# EAGLE design breakouts (EAGLE 6.5.0)
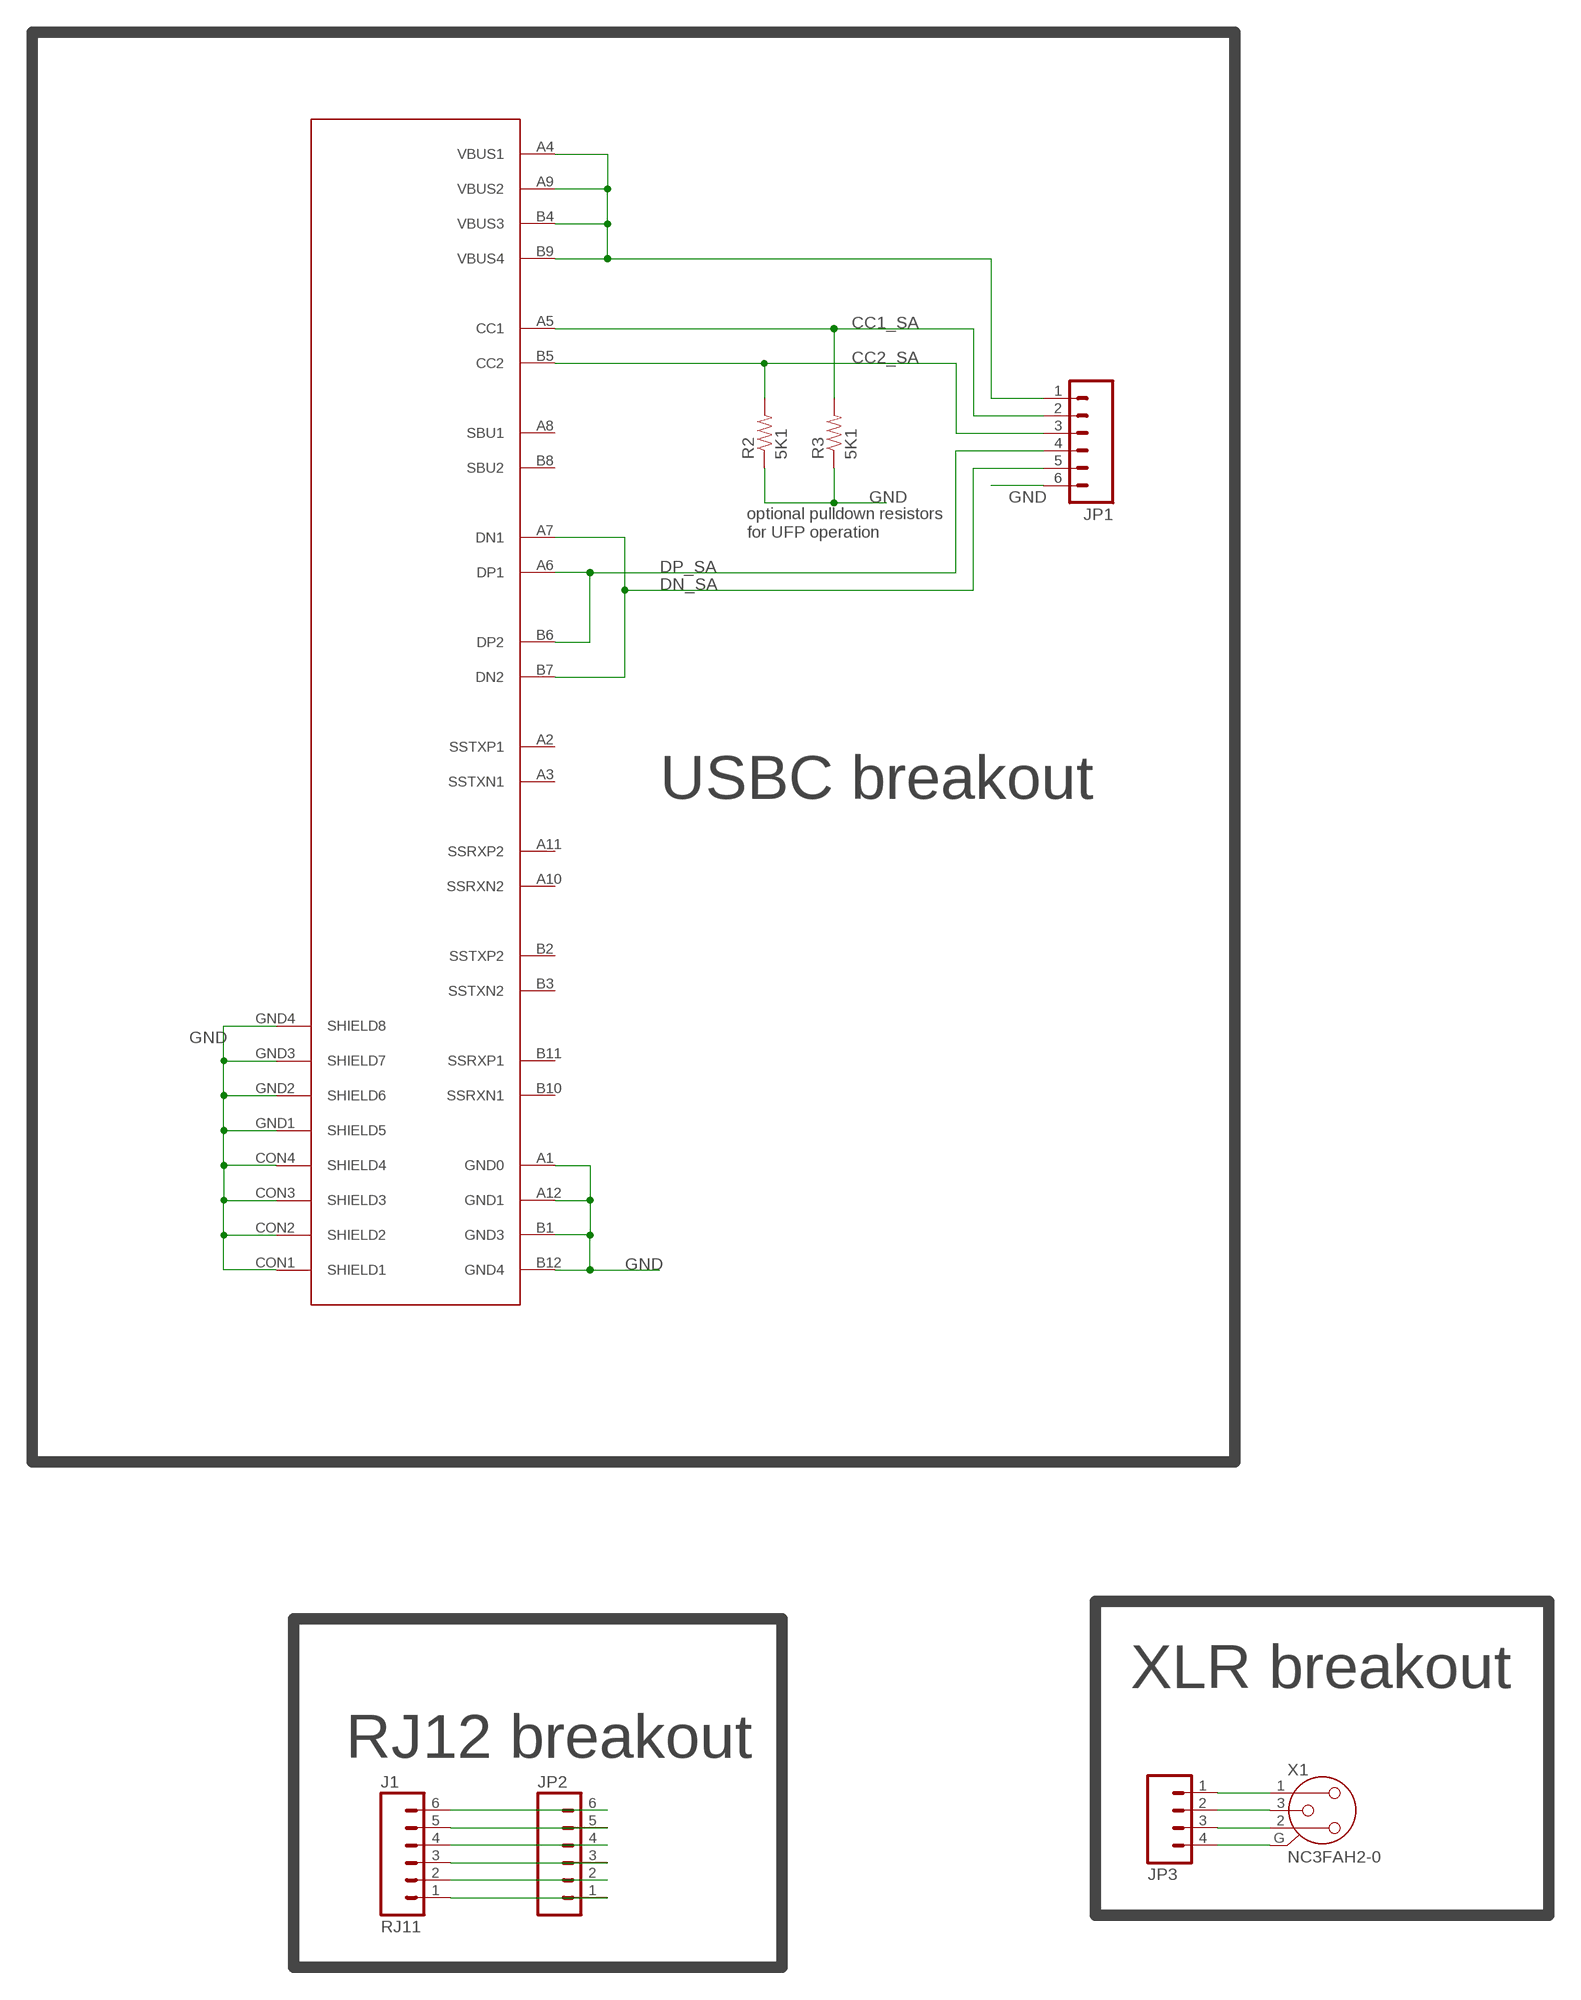
[diagram p0: schematic, sheet 1, part 1 of 2]
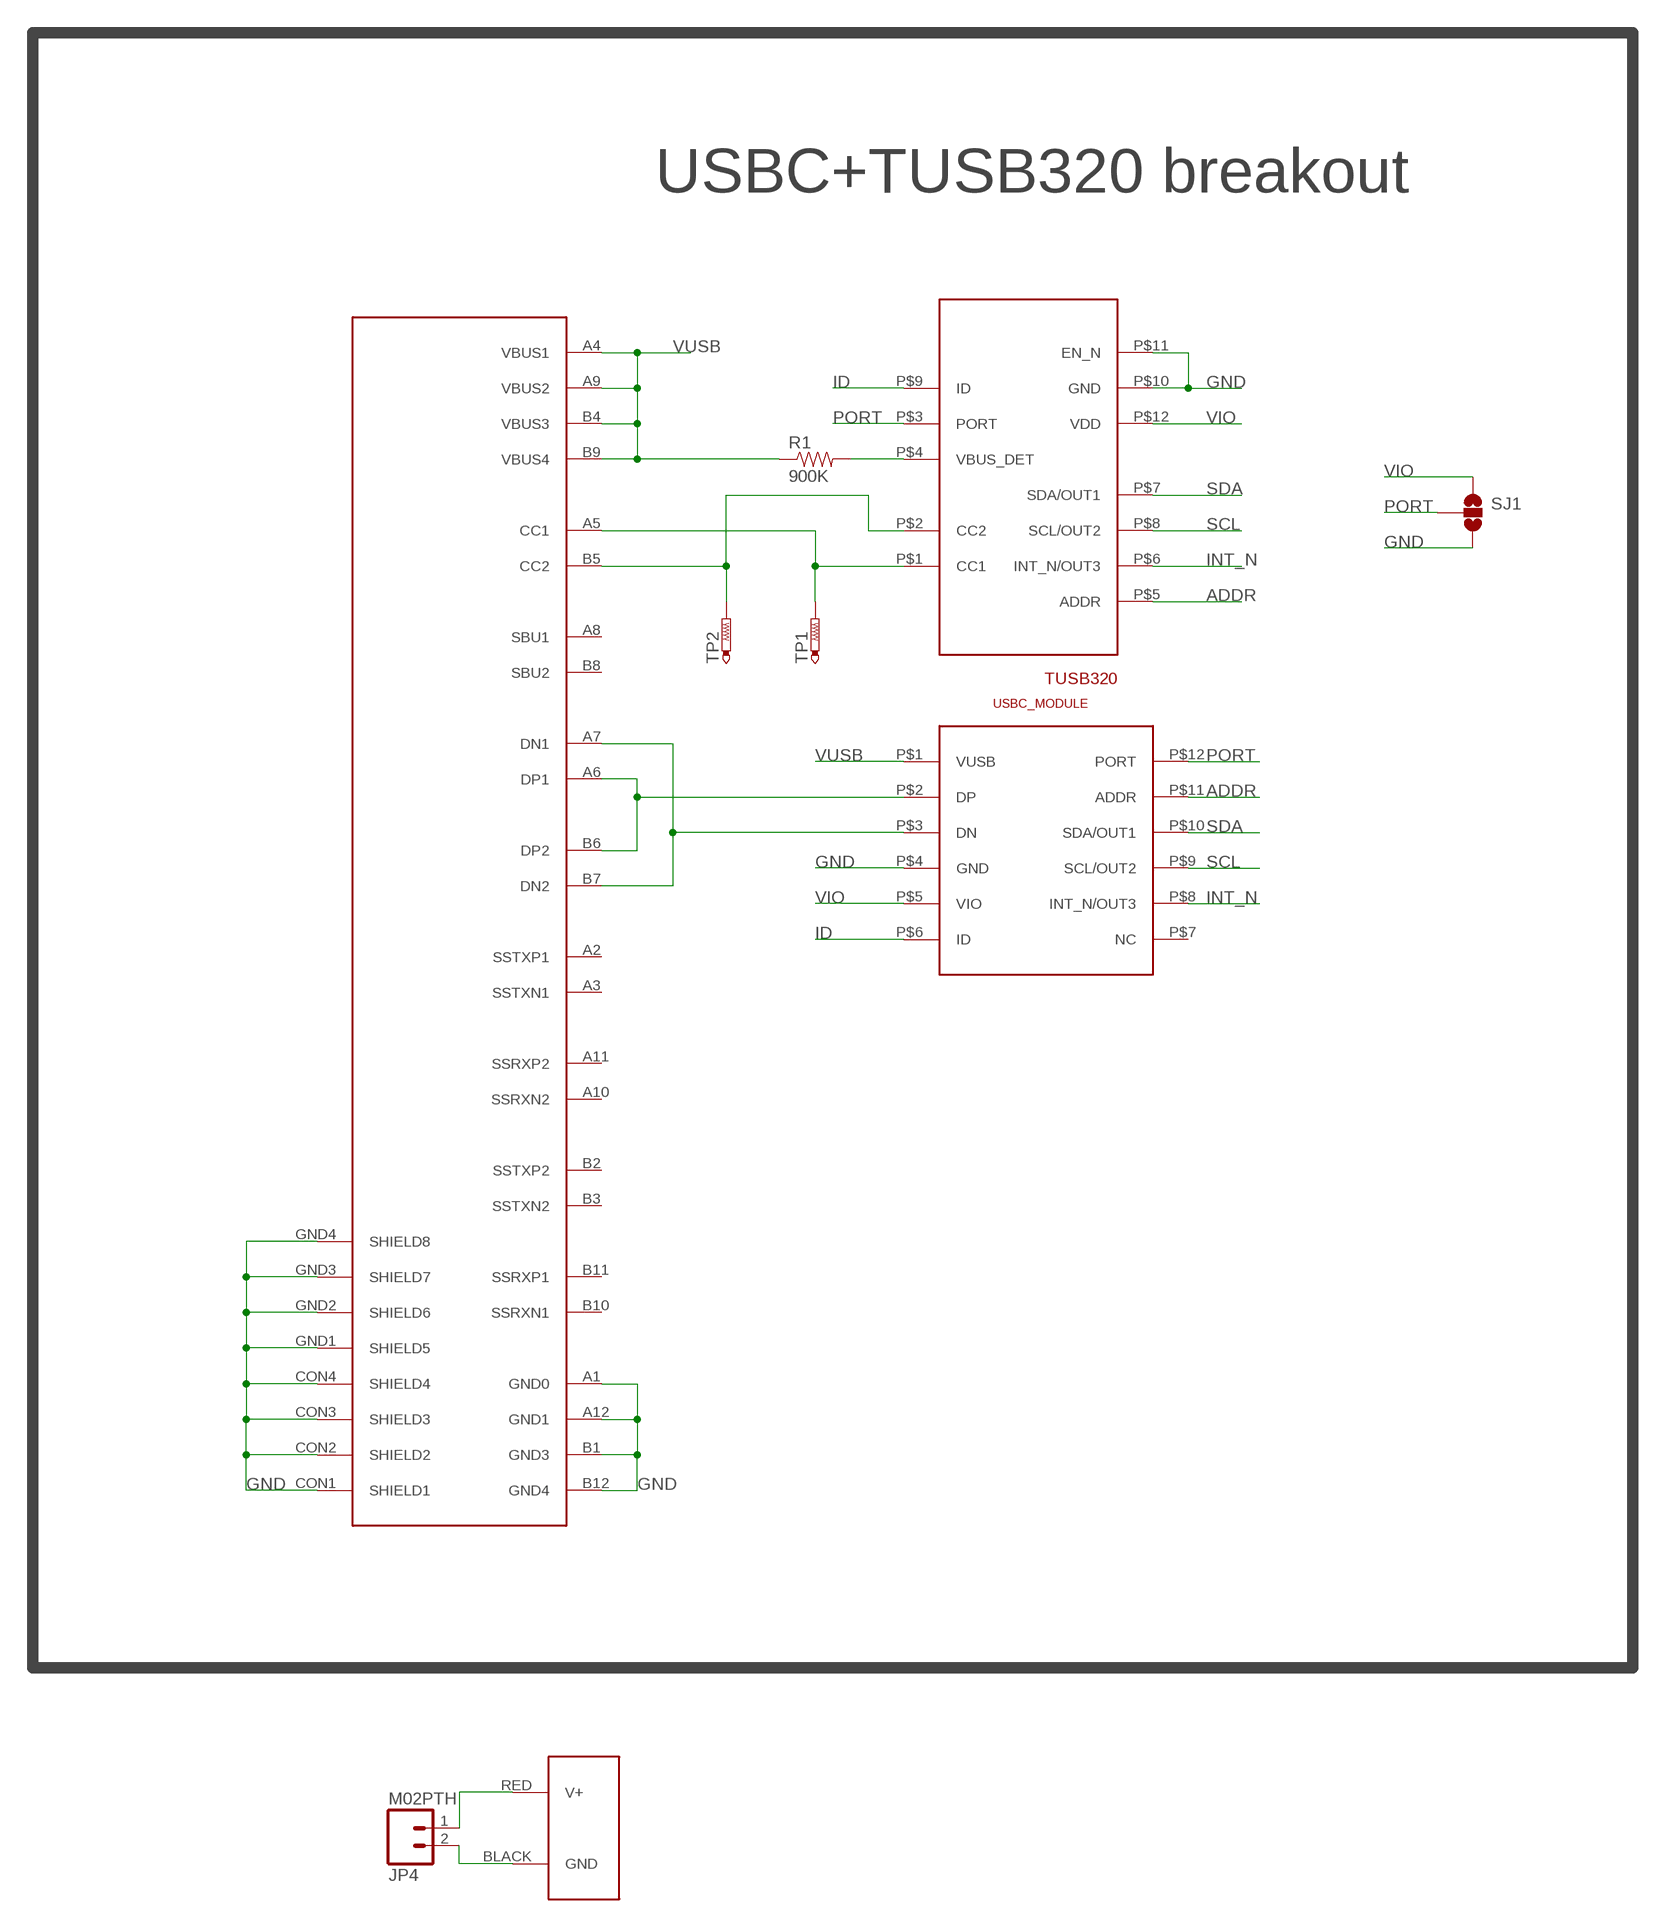
[diagram p1: schematic, sheet 1, part 2 of 2]

## Parts
CONN1  USB-C_WURTH_632723X00011USB-C  [USB-C_WURTH_632723X00011]
CONN2  USB-C_WURTH_632723X00011USB-C  [USB-C_WURTH_632723X00011]
J1  RJ11  RJ11-6PTH  [RJ11-6]
J2  POWERPOLE_POWER25A  [POWERPOLE_PAIR_25A]
JP1  M06SIP  [1X06]
JP2  M06SIP  [1X06]
JP3  M04PTH  [1X04]
JP4  M02PTH  [1X02]
R1  900K  RESISTOR0603-RES  [0603-RES]
R2  5K1  RESISTOR0603-RES  [0603-RES]
R3  5K1  RESISTOR0603-RES  [0603-RES]
SJ1  SOLDERJUMPER_2WAYS  [SJ_3]
TP1  PTR1TP10R  [TP10R]
TP2  PTR1TP10R  [TP10R]
U$1  TUSB320XQFN  [X2QFN]
U$2  USBC_BREAKOUTPDIP  [DIP12_6WIDE]
X1  NC3FAH2-0  [NC3FAH2-0]

## Nets
ADDR: U$1.P$5(ADDR) U$2.P$11(ADDR)
CC1: CONN1.A5(CC1) TP1.TP U$1.P$1(CC1)
CC1_SA: CONN2.A5(CC1) JP1.2 R3.2
CC2: CONN1.B5(CC2) TP2.TP U$1.P$2(CC2)
CC2_SA: CONN2.B5(CC2) JP1.3 R2.2
DN: CONN1.A7(DN1) CONN1.B7(DN2) U$2.P$3(DN)
DN_SA: CONN2.A7(DN1) CONN2.B7(DN2) JP1.5
DP: CONN1.A6(DP1) CONN1.B6(DP2) U$2.P$2(DP)
DP_SA: CONN2.A6(DP1) CONN2.B6(DP2) JP1.4
GND: CONN1.A1(GND0) CONN1.A12(GND1) CONN1.B1(GND3) CONN1.B12(GND4) CONN1.CON1(SHIELD1) CONN1.CON2(SHIELD2) CONN1.CON3(SHIELD3) CONN1.CON4(SHIELD4) CONN1.GND1(SHIELD5) CONN1.GND2(SHIELD6) CONN1.GND3(SHIELD7) CONN1.GND4(SHIELD8) CONN2.A1(GND0) CONN2.A12(GND1) CONN2.B1(GND3) CONN2.B12(GND4) CONN2.CON1(SHIELD1) CONN2.CON2(SHIELD2) CONN2.CON3(SHIELD3) CONN2.CON4(SHIELD4) CONN2.GND1(SHIELD5) CONN2.GND2(SHIELD6) CONN2.GND3(SHIELD7) CONN2.GND4(SHIELD8) JP1.6 R2.1 R3.1 SJ1.3 U$1.P$10(GND) U$1.P$11(EN_N) U$2.P$4(GND)
ID: U$1.P$9(ID) U$2.P$6(ID)
INT_N: U$1.P$6(INT_N/OUT3) U$2.P$8(INT_N/OUT3)
N$1: J1.1 JP2.1
N$2: J1.2 JP2.2
N$3: J1.3 JP2.3
N$4: J1.4 JP2.4
N$5: J1.5 JP2.5
N$6: J1.6 JP2.6
N$7: JP3.1 X1.1
N$8: JP3.2 X1.3
N$9: R1.2 U$1.P$4(VBUS_DET)
N$10: JP3.3 X1.2
N$11: JP3.4 X1.G
N$12: J2.RED(V+) JP4.1
N$13: J2.BLACK(GND) JP4.2
PORT: SJ1.2 U$1.P$3(PORT) U$2.P$12(PORT)
SCL: U$1.P$8(SCL/OUT2) U$2.P$9(SCL/OUT2)
SDA: U$1.P$7(SDA/OUT1) U$2.P$10(SDA/OUT1)
VBUS_SA: CONN2.A4(VBUS1) CONN2.A9(VBUS2) CONN2.B4(VBUS3) CONN2.B9(VBUS4) JP1.1
VIO: SJ1.1 U$1.P$12(VDD) U$2.P$5(VIO)
VUSB: CONN1.A4(VBUS1) CONN1.A9(VBUS2) CONN1.B4(VBUS3) CONN1.B9(VBUS4) R1.1 U$2.P$1(VUSB)
Unconnected: CONN1.A2(SSTXP1) CONN1.A3(SSTXN1) CONN1.A8(SBU1) CONN1.A10(SSRXN2) CONN1.A11(SSRXP2) CONN1.B2(SSTXP2) CONN1.B3(SSTXN2) CONN1.B8(SBU2) CONN1.B10(SSRXN1) CONN1.B11(SSRXP1) CONN2.A2(SSTXP1) CONN2.A3(SSTXN1) CONN2.A8(SBU1) CONN2.A10(SSRXN2) CONN2.A11(SSRXP2) CONN2.B2(SSTXP2) CONN2.B3(SSTXN2) CONN2.B8(SBU2) CONN2.B10(SSRXN1) CONN2.B11(SSRXP1) U$2.P$7(NC)

## Notes on the sheet
- USBC+TUSB320 breakout
- optional pulldown resistors
  for UFP operation
- USBC breakout
- XLR breakout
- RJ12 breakout

## Library data of the parts
CONN1 CONN2 = USB-C:USB-C_WURTH_632723X00011: Wurth USB C connector
J1 = SparkFun-Connectors:RJ11-6: RJ11 Jack Simple 6 pin RJ11 jack. Commonly found on CAT3 devices and Microchip programmers. SKU: PRT-00132; PROD_ID: CONN-08590
J2 = powerpoles:POWERPOLE_POWER: Anderson Powerpole Power Connector using ameteur radio standard layout
JP1 JP2 = SparkFun:M06: Header 6 Standard 6-pin 0.1" header. Use with straight break away headers (SKU : PRT-00116), right angle break away headers (PRT-00553), swiss pins (PRT-00743), machine pins (PRT-00117), and female headers (PRT-00115). Molex polarized connector foot print use with SKU : PRT-08094 with associated crimp pins and housings. NOTES ON THE VARIANTS LOCK and LOCK_LONGPADS... This footprint was designed to help hold the alignment of a through-hole component (i.e. 6-pin header) while soldering it into place. You may notice that each hole has been shifted either up or down by 0.005 of an inch from it's more standard position (which is a perfectly straight line). This slight alteration caused the pins (the squares in the middle) to touch the edges of the holes. Because they are alternating, it causes a "brace" to hold the component in place. 0.005 has proven to be the perfect amount of "off-center" position when using our standard breakaway headers. Although looks a little odd when you look at the bare footprint, once you have a header in there, the alteration is very hard to notice. Also, if you push a header all the way into place, it is covered up entirely on the bottom side. This idea of altering the position of holes to aid alignment will be further integrated into the Sparkfun Library for other footprints. It can help hold any component with 3 or more connection pins.
JP3 = SparkFun-Connectors:M04: Header 4 Standard 4-pin 0.1" header. Use with straight break away headers (SKU : PRT-00116), right angle break away headers (PRT-00553), swiss pins (PRT-00743), machine pins (PRT-00117), and female headers (PRT-00115). Molex polarized connector foot print use with SKU : PRT-08231 with associated crimp pins and housings. 1MM SMD Version SKU: PRT-10208
JP4 = SparkFun-Connectors:M02: Standard 2-pin 0.1" header. Use with - straight break away headers ( PRT-00116) - right angle break away headers (PRT-00553) - swiss pins (PRT-00743) - machine pins (PRT-00117) - female headers (PRT-00115) Molex polarized connector foot print use with: PRT-08233 with associated crimp pins and housings. 2.54_SCREWTERM for use with PRT-10571. 3.5mm Screw Terminal footprints for PRT-08084 5mm Screw Terminal footprints for use with PRT-08432
R1-R3 = SparkFun-Passives:RESISTOR: Resistor Basic schematic elements and footprints for 0603, 1206, and PTH resistors.
SJ1 = SparkFun:SOLDERJUMPER_2WAY: Solder Jumper 2 way solder jumper
TP1 TP2 = testpad:PTR1: TEST PIN
U$1 = USB-C:TUSB320: TUSB320 USB Type-C Configuration Channel Logic and Port Control
U$2 = USB-C:USBC_BREAKOUT: USB Type-C brekout module with TUSB320 Controler
X1 = con-neutrik_ag:NC3: Neutrik Audio Connector XLR SERIES Stereo 1/4" jack Source: www.neutrik.com/; MPN: NC3FAH-2-0; OC_FARNELL: unknown; OC_NEWARK: 11J5829

## Board
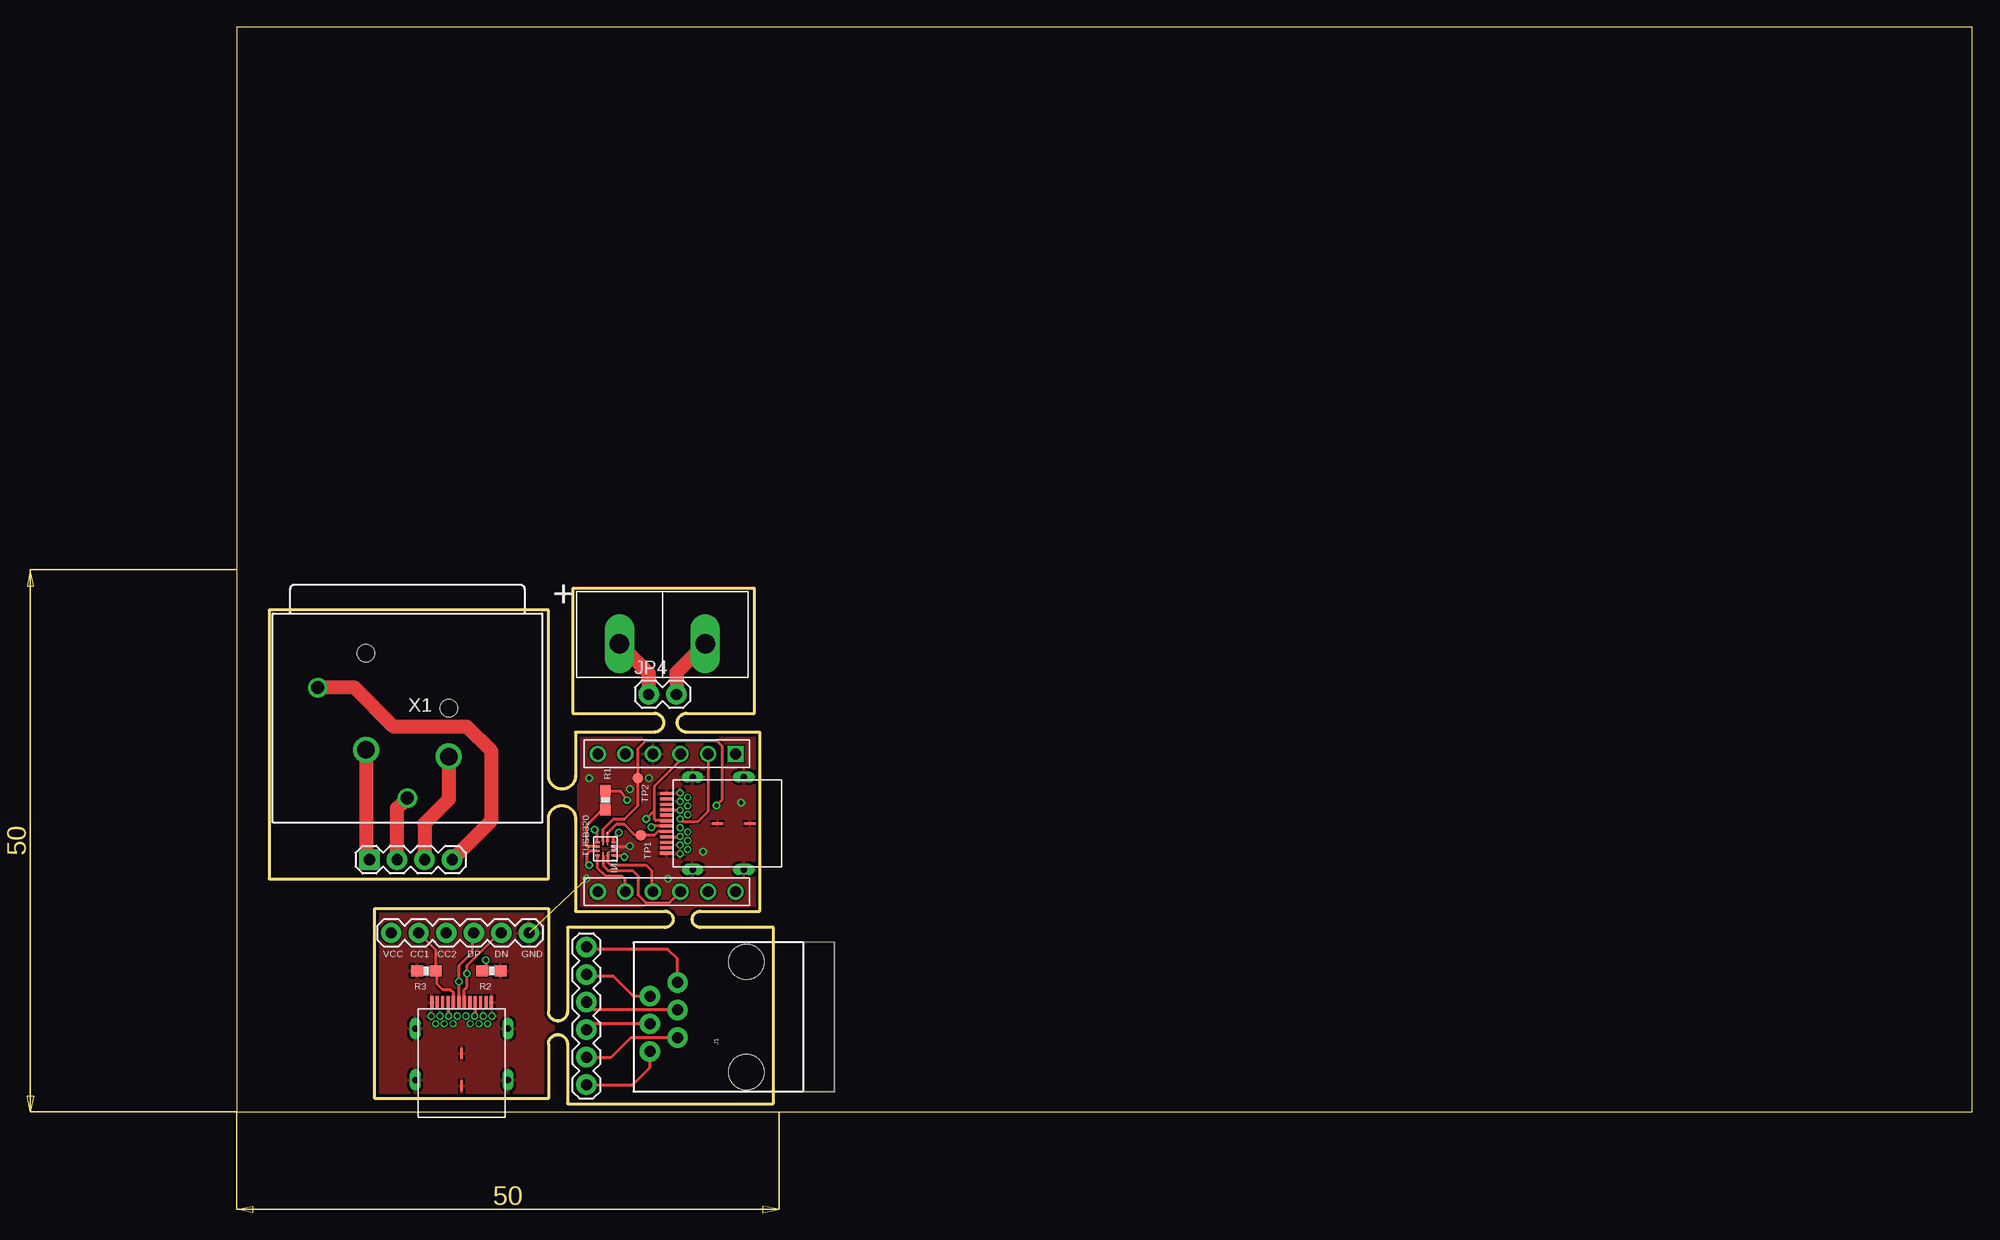
[diagram p2: board, top side]
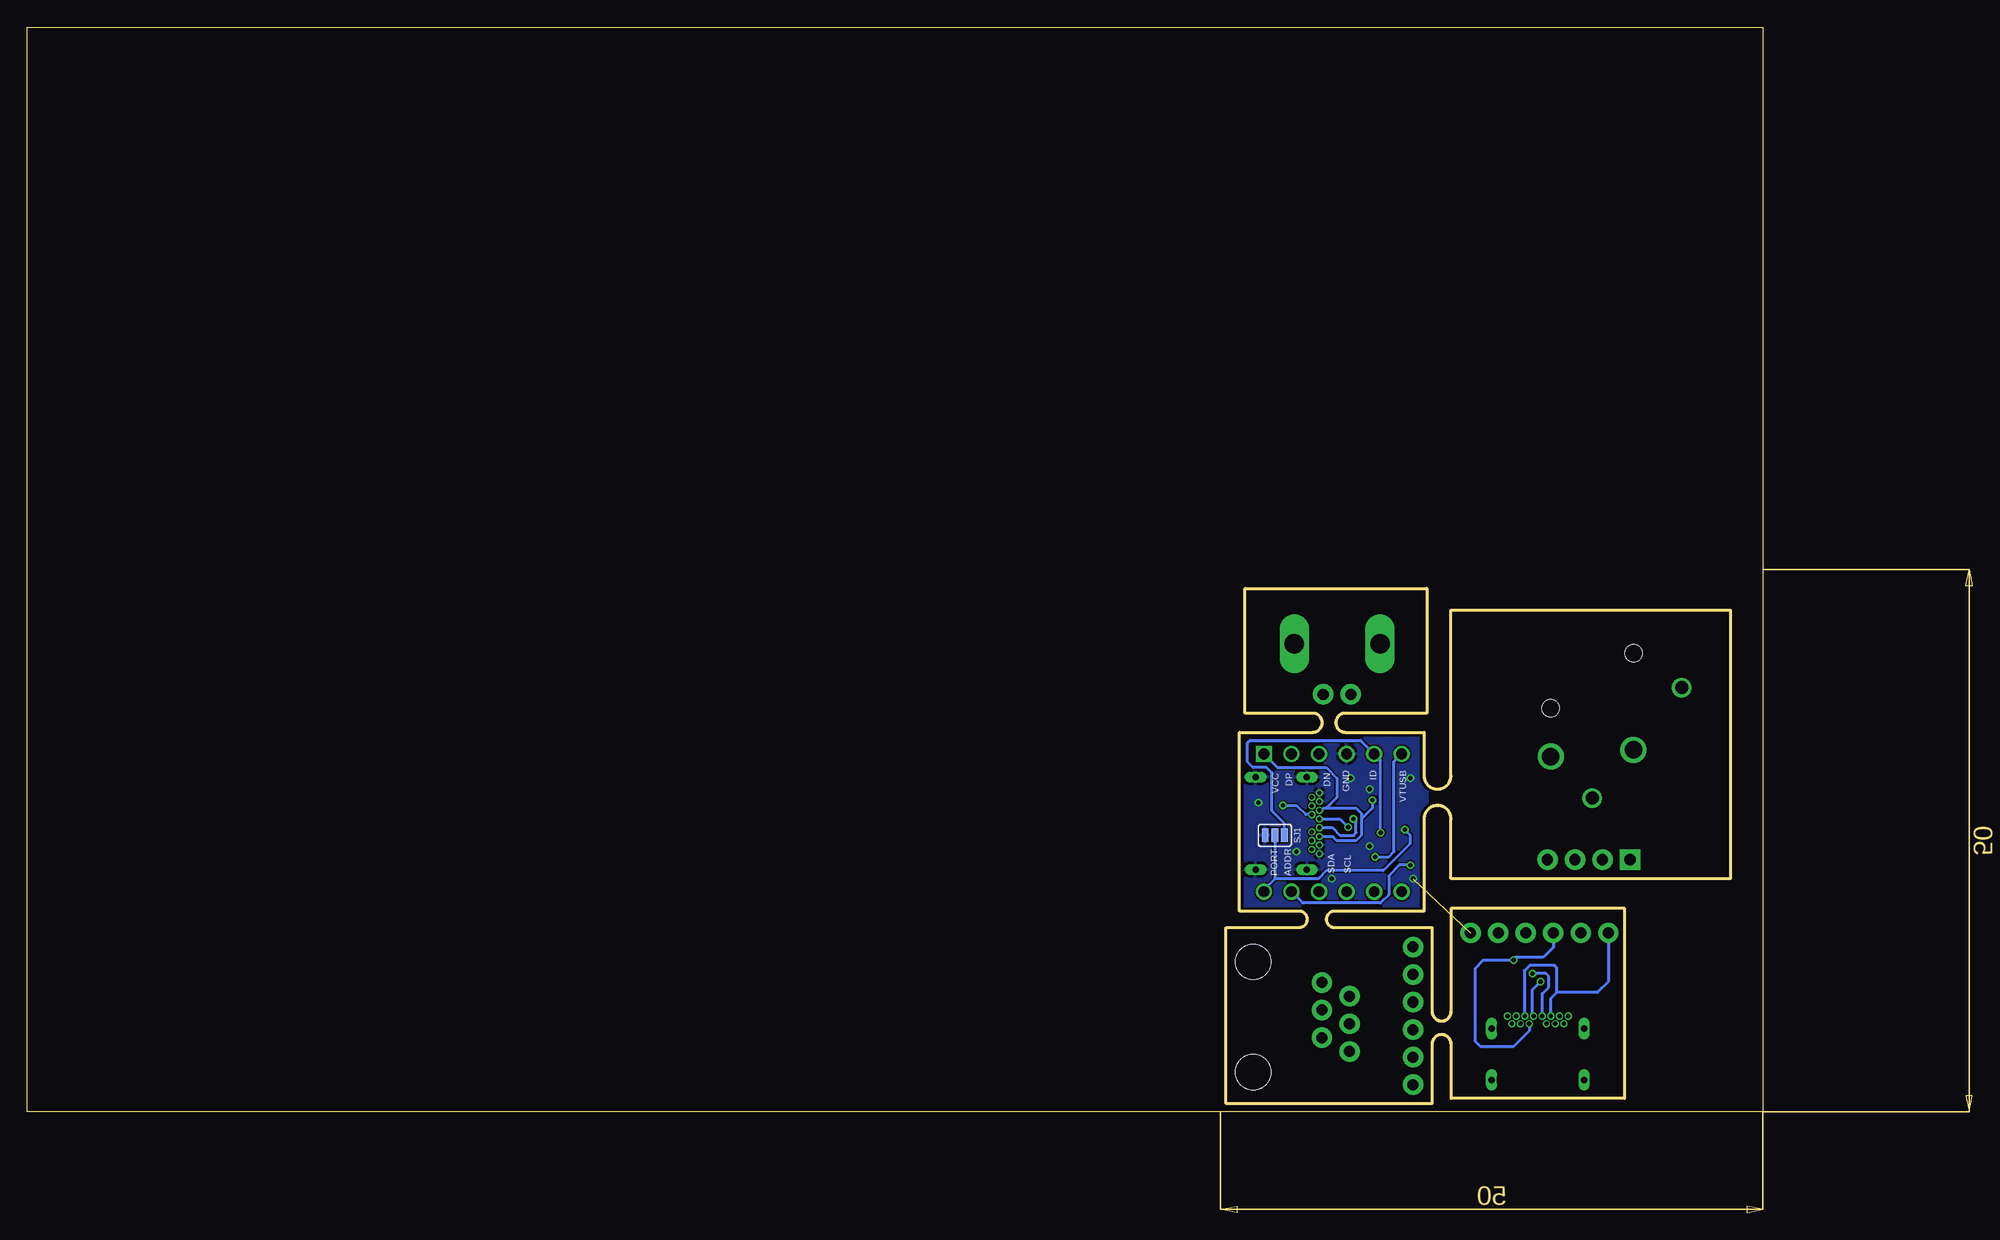
[diagram p3: board, bottom side, seen from below]

Size 160 x 100 mm. Coordinates in mm from the lower left corner, seen from the top.
Outline: 0,0 160,0 160,100 0,100 0,0
Outline: 12.75,1.25 28.75,1.25 28.75,6.25 arc-180 30.5,6.25 30.5,0.75 49.5,0.75 49.5,17 42.75,17 arc-180 42.75,18.5 48.25,18.5 48.25,35 41.5,35 arc-180 41.5,36.75 47.75,36.75 47.75,48.25 31,48.25 31,36.75 38.5,36.75 arc-180 38.5,35 31.25,35 31.25,31 arc-180 28.75,31 28.75,46.25 3,46.25 3,21.5 28.75,21.5 28.75,27 arc-180 31.25,27 31.25,18.5 39.5,18.5 arc-180 39.5,17 30.5,17 30.5,9.25 arc-180 28.75,9.25 28.75,18.75 12.75,18.75 12.75,1.25
Copper layers (1*16): Top 0.035mm / dielectric 1.5mm / Bottom 0.035mm
Design rules "dirt_cheap_dirty_boards.v1 *": minimum track width 5mil, minimum drill 12mil, track to track 5mil, track to pad 5mil, pad to pad 5mil, via to via 5mil, smd to smd 0mil, copper to edge 10mil, drill to drill 10mil, minimum pad ring 0.1mm, minimum via ring 6mil, stop-mask expansion 0mil, vias tented up to drill 25mil, thermal gap 10mil

### Footprints (pad centres in the part's own frame; a part is rotated, then mirrored left to right if it is on the bottom)
USB-C_WURTH_632723X00011 = smd 0.3 x 1.2: A1 -2.75,10.58; A2 -2.25,10.58; A3 -1.75,10.58; A4 -1.25,10.58; A5 -0.75,10.58; A6 -0.25,10.58; A7 0.25,10.58; A8 0.75,10.58; A9 1.25,10.58; A10 1.75,10.58; A11 2.25,10.58; A12 2.75,10.58 | drill 0.4 pad 0.65: B1 2.8,9.33; B2 2.4,8.63; B3 1.6,8.63; B4 1.2,9.33; B5 0.8,8.63; B6 0.4,9.33; B7 -0.4,9.33; B8 -0.8,8.63; B9 -1.2,9.33; B10 -1.6,8.63; B11 -2.4,8.63; B12 -2.8,9.33; GND1 2,9.33; GND2 -2,9.33 | drill 0.6 pad 1 long: CON1 4.27,8.18; CON2 4.27,3.45; CON3 -4.27,3.45; CON4 -4.27,8.18 | smd 0.2 x 1: GND3 0,2.9; GND4 0,5.9
RJ11-6 = drill 1.016 pad 1.88: 1 -3.175,8.89; 2 -1.905,6.35; 3 -0.635,8.89; 4 0.635,6.35; 5 1.905,8.89; 6 3.175,6.35 | hole 3.251: -5.08,0; 5.08,0
POWERPOLE_PAIR_25A = drill 1.8 long: BLACK 3.95,-0.85; RED -3.95,-0.85
1X06 = drill 1.016 pad 1.88: 1 0,0; 2 2.54,0; 3 5.08,0; 4 7.62,0; 5 10.16,0; 6 12.7,0
1X04 = drill 1.016 pad 1.88 square: 1 0,0 | drill 1.016 pad 1.88: 2 2.54,0; 3 5.08,0; 4 7.62,0
1X02 = drill 1.016 pad 1.88: 1 0,0; 2 2.54,0
0603-RES = smd 1.1 x 1: 1 -0.85,0; 2 0.85,0
SJ_3 = smd 0.635 x 1.27: 1 -0.889,0; 2 0,0; 3 0.889,0
TP10R = smd 1 x 1: TP 0,0
X2QFN = smd 0.7 x 0.2: P$1 -0.65,0.2; P$2 -0.65,-0.2; P$7 0.65,-0.2; P$8 0.65,0.2 | smd 0.2 x 0.5: P$3 -0.6,-0.75; P$4 -0.2,-0.75; P$5 0.2,-0.75; P$6 0.6,-0.75; P$9 0.6,0.75; P$10 0.2,0.75; P$11 -0.2,0.75; P$12 -0.6,0.75
DIP12_6WIDE = drill 1 square: P$1 0,0 | drill 1: P$2 0,-2.54; P$3 0,-5.08; P$4 0,-7.62; P$5 0,-10.16; P$6 0,-12.7; P$7 12.7,-12.7; P$8 12.7,-10.16; P$9 12.7,-7.62; P$10 12.7,-5.08; P$11 12.7,-2.54; P$12 12.7,0
NC3FAH2-0 = drill 1.6: 1 -3.81,0.635; 2 3.81,0 | drill 1.2: 3 0,-3.815; G -8.25,6.355 | hole 1.6: -3.81,9.525; 3.81,4.445

### Placement (x,y rotation side)
CONN1  50.22,26.6 90 top
CONN2  20.75,-0.5 0 top
J1  47,8.75 90 top
J2  39.25,44 0 top
JP1  14.25,16.5 0 top
JP2  32.25,2.5 90 top
JP3  12.25,23.25 0 top
JP4  38,38.5 0 top
R1  34,28.75 270 top
R2  23.5,13 180 top
R3  17.5,13 0 top
SJ1  45,25.5 180 bottom
TP1  37.25,25.5 90 top
TP2  37,30.75 90 top
U$1  34,24.25 270 top
U$2  46,33 270 top
X1  15.75,32.75 0 top

### Tracks (layer width: path | path; a pad name or v marks a point on that pad's centre or on a via)
ADDR  (via drill 0.4)
  Top 0.254: U$1.P$5 32.55,24.05 32.25,23.75 32.25,23 v32.5,22.75
  Bottom 0.254: v32.5,22.75 33.5,22.75 34.5,21.75 34.5,20 35.25,19.25 42.41,19.25 U$2.P$11
CC1
  Top 0.254: CONN1.A5 38.85,25.85 38.5,25.5 TP1.TP 36.75,25.5 35.75,26.5 35,26.5 34.2,25.7 U$1.P$1
CC1_SA
  Top 0.254: JP1.2 18.35,14.94 R3.2 18.5,12.85 18.5,11.75 19,11.25 19.75,11.25 20,11 CONN2.A5
CC2  (via drill 0.4)
  Top 0.254: U$1.P$2 33.8,26.05 34.75,27 35.75,27 37,28.25 TP2.TP 37,33.5 37.75,34.25 44.25,34.25 44.75,33.75 44.75,28.75 v44.25,28.25
  Bottom 0.254: v44.25,28.25 43,28.25 42.15,27.4 CONN1.B5
CC2_SA  (via drill 0.4)
  Top 0.254: v23,14 23,13.35 R2.2
  Bottom 0.254: JP1.3 19.33,15.17 20.25,14.25 22.75,14.25 v23,14 25.75,14 26.5,13.25 26.5,6.5 26,6 23,6 21.55,7.45 CONN2.B5
DN  (via drill 0.4)
  Top 0.254: U$2.P$3 40.92,32.42 38.5,30 38.5,27.75 | 38.5,27.75 38.5,27 38.65,26.85 CONN1.A7 | v37.75,27 38.5,27.75
  Bottom 0.254: CONN1.B7 39.7,26.2 39,25.5 37.75,25.5 37.5,25.75 37.5,26.75 v37.75,27
DN_SA  (via drill 0.4)
  Top 0.254: JP1.5 24.25,16.5 21.25,13.5 v21.25,12.75 21.25,11.5 21,11.25 CONN2.A7
  Bottom 0.254: CONN2.B7 20.35,10.9 19.75,11.5 19.75,12.5 20,12.75 v21.25,12.75
DP  (via drill 0.4)
  Top 0.254: U$2.P$2 43.46,27.71 42.5,26.75 41.14,26.75 CONN1.B6 | CONN1.A6 38.35,26.35 v38.25,26.25
  Bottom 0.254: CONN1.B6 39,27 v38.25,26.25
DP_SA  (via drill 0.4)
  Top 0.254: CONN2.A6 v20.5,12 20.5,13.5 21.75,14.75 21.75,16.38 JP1.4
  Bottom 0.254: CONN2.B6 21.25,8.93 21.25,11.25 v20.5,12
GND  (via drill 0.4)  (1 unrouted)
  Top 0.254: U$1.P$11 36.2,24.45 v36.25,24.5
  other vias: 36.25,29.75 32.5,30.75 38,30.75 43,24 46.5,28.5 39.75,21.5 32.25,21.5
  pour Top: 31.5,18.25 49,18.25 49,35.25 31.5,35.25
  pour Bottom: 31,18.25 48.75,18.25 48.75,35.25 31,35.25
  pour Top: 11.75,19.5 11.75,0.75 29.25,0.75 29.25,19.5
ID  (via drill 0.4)
  Top 0.254: U$1.P$9 35.6,23.65 v35.75,23.5
  Bottom 0.254: v35.75,23.5 34.5,23.5 34,24 34,32.3 U$2.P$6
INT_N
  Top 0.254: U$2.P$8 35.75,20.39 35.75,21.5 35.5,21.75 34,21.75 33.25,22.5 U$1.P$6
N$1
  Top 0.254: JP2.1 36.5,2.5 38.11,4.11 J1.1
N$2
  Top 0.254: J1.2 36.34,6.84 34.5,5 32.29,5 JP2.2
N$3
  Top 0.254: J1.3 32.78,8.12 JP2.3
N$4
  Top 0.254: J1.4 32.98,9.38 JP2.4
N$5
  Top 0.254: J1.5 36.59,10.65 34.75,12.5 32.41,12.5 JP2.5
N$6
  Top 0.254: J1.6 40.65,14.1 39.75,15 32.45,15 JP2.6
N$7
  Top 1.27: X1.1 11.94,23.56 JP3.1
N$8
  Top 1.27: JP3.2 14.79,27.98 X1.3
N$9
  Top 0.254: U$1.P$4 32.3,24.45 32.25,24.5 32.25,26.4 33.5,27.65 R1.2
N$10
  Top 1.27: X1.2 19.56,28.81 17.33,26.58 JP3.3
N$11
  Top 1.27: JP3.4 23.5,26.88 23.5,33.25 21.25,35.5 14.5,35.5 10.89,39.1 X1.G
N$12
  Top 1.27: J2.RED 38,40.45 JP4.1
N$13
  Top 1.27: J2.BLACK 40.54,40.49 JP4.2
PORT  (via drill 0.4)
  Top 0.254: U$1.P$3 33.25,25.75 v33,26
  Bottom 0.254: U$2.P$12 46,20.5 45,21.5 | SJ1.2 45,21.5 | v33,26 32.5,25.5 32.5,24.75 35,22.25 40.25,22.25 41,21.5 45,21.5
SCL
  Top 0.254: U$1.P$8 34.2,23.05 34.5,22.75 37.75,22.75 38.25,22.25 38.25,20.43 U$2.P$9
SDA
  Top 0.254: U$1.P$7 33.8,22.7 34.25,22.25 36.5,22.25 37,21.75 37,20 37.75,19.25 39.87,19.25 U$2.P$10
VBUS_SA
  Top 0.254: CONN2.A4 19.5,8.88 CONN2.B9 | CONN2.A9 22,8.88 CONN2.B4
  Bottom 0.254: CONN2.B9 19.55,10.45 19,11 | 19,11 19,13.25 19.25,13.5 21.5,13.5 22,13 22,8.88 CONN2.B4 | JP1.1 14.25,12 15.25,11 19,11
VIO  (via drill 0.4)
  Top 0.254: U$1.P$12 34.75,25.25 v35.25,25.75
  Bottom 0.254: v35.25,25.75 35.25,32.41 U$2.P$5 37.09,34.25 47.25,34.25 47.5,34 47.5,32.25 47,31.75 45.75,31.75 45.25,31.25 45.25,27.75 44.11,26.61 SJ1.1 44.11,25.36
VUSB  (via drill 0.4)
  Top 0.254: CONN1.A4 40.84,25.35 CONN1.B9 | CONN1.A9 40.84,27.85 CONN1.B4 | R1.1 35.4,29.6 v36,28.75
  Bottom 0.254: CONN1.B4 40.7,27.8 40.5,28 40.25,28 | 40.25,28 37.5,28 37,27.5 37,27 | 37,27 37,25.5 37.5,25 39.29,25 CONN1.A4 40.84,25.35 CONN1.B9 | U$2.P$1 44.75,31.75 40.25,31.75 39.25,30.75 39.25,29 40.25,28 | v36,28.75 36,28 37,27

### Text on the board
tNames: TUSB320 | INT_N | VCC | CC1 | CC2 | DP | DN | GND
bNames: VTUSB | ID | GND | DN | DP | VCC | SCL | SDA | ADDR | PORT